# Altium project BBiQ.PrjPcb
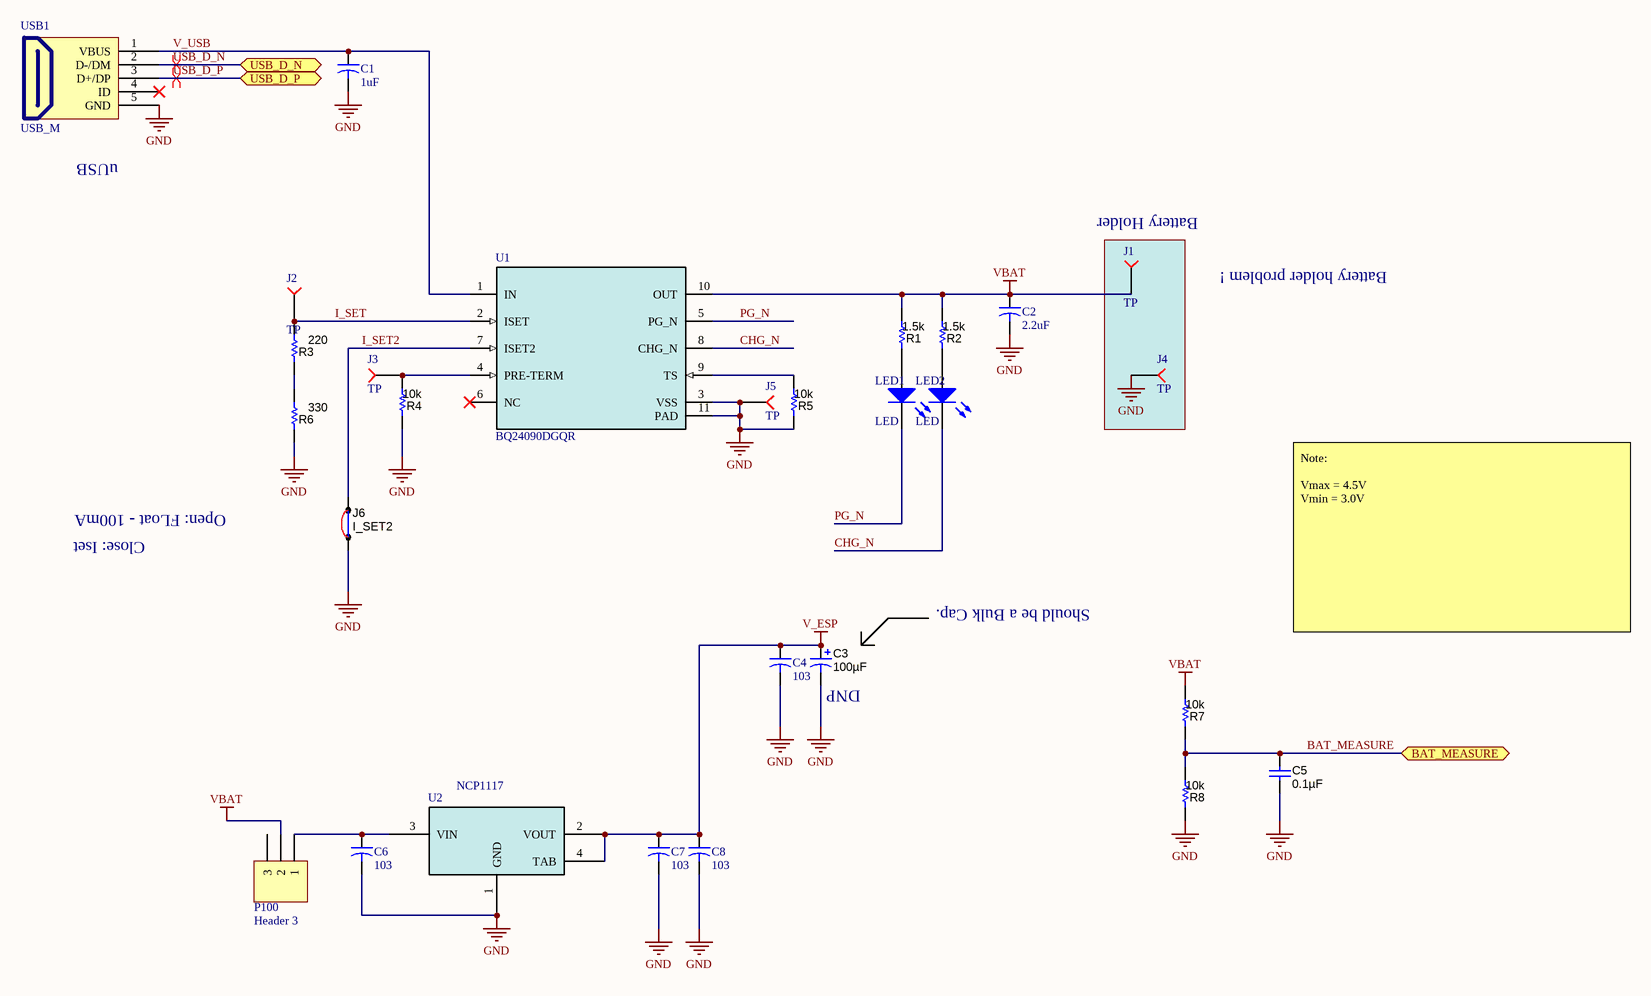
[diagram p0: [2]-Charger.SchDoc]
5 sheets, 174 parts. Net scope: flat (ports and power ports of the same name join across sheets).
Board file: BBiQ_PCB.PcbDoc
Sheets:
  [2]-Charger.SchDoc
  [1]-Cover.SchDoc
  [3]-MCU.SchDoc
  [4]-Wifi.SchDoc
  [5]-Display.SchDoc

## Sheet [2]-Charger.SchDoc
size A3

### Parts
C1  1uF  [0603]
C2  2.2uF  [0603]
C3  ValueDisplayed: 100µF  [3528-21]  (hidden comment: 293D107X96R3B2TE3)
C4  103  [0603]
C5  ValueDisplayed: 0.1µF  [0603]  (hidden comment: 0603YC104JAT2A)
C6  103  [0603]
C7  103  [0603]
C8  103  [0603]
J1  TP  [TP]
J2  TP  [TP]
J3  TP  [TP]
J4  TP  [TP]
J5  TP  [TP]
J6  I_SET2  [HDR1X2]
LED1  LED  [LED-0603-YELLOW]
LED2  LED  [LED-0603-YELLOW]
P100  Header 3  [SW_Slide]
R1  1.5k  [0603]
R2  1.5k  [0603]
R3  220  [0603]
R4  10k  [0603]
R5  10k  [0603]
R6  330  [0603]
R7  10k  [0603]
R8  10k  [0603]
U1  BQ24090DGQR  [DGQ0010D_NV_N]
U2  NCP1117  [SOT-223B_L]
USB1  USB_M  [USB_MICRO_SMD]

### Ports
BAT_MEASURE (bidir), USB_D_N (bidir), USB_D_P (bidir)

### Nets
GND: C1.2 C2.2 C3.2(-) C4.2 C5.2 C6.2 C7.2 C8.2 J4.0 J5.0 J6.1 R4.1 R5.1 R6.1 R8.1 U1.3(VSS) U1.11(PAD) U2.1(GND) USB1.5(GND)
V_ESP: C3.1(+) C4.1 C7.1 C8.1 U2.2(VOUT) U2.4(TAB)
VBAT: C2.1 J1.0 P100.2 R1.2 R2.2 R7.2 U1.10(OUT)
BAT_MEASURE: C5.1 R7.1 R8.2 ; port BAT_MEASURE
CHG_N: LED2.2(K) U1.8(CHG_N)
I_SET: J2.0 R3.2 U1.2(ISET)
I_SET2: J6.2 U1.7(ISET2)
PG_N: LED1.2(K) U1.5(PG_N)
USB_D_N: USB1.2(D-/DM) ; port USB_D_N
USB_D_P: USB1.3(D+/DP) ; port USB_D_P
V_USB: C1.1 U1.1(IN) USB1.1(VBUS)
NetC6_1: C6.1 P100.1 U2.3(VIN)
NetJ3_0: J3.0 R4.2 U1.4(PRE-TERM)
NetLED1_1: LED1.1(A) R1.1
NetLED2_1: LED2.1(A) R2.1
NetR3_1: R3.1 R6.2
NetR5_2: R5.2 U1.9(TS)

Not connected (* = marked no-connect by the designer): P100 3; U1 6(NC)*; USB1 4(ID)*

### Layout directives
differential pair: USB_D_N, USB_D_P

### Notes on the sheet
- uUSB
- (near J1) Battery Holder
- (near J1) Battery holder problem !
- Open: FLoat - 100mA
- Close: Iset
- Should be a Bulk Cap.
- Note:
  Vmax = 4.5V
  Vmin = 3.0V
- (near C3) DNP
- Title
- Size:
- Date:
- A3
- Number:
- Time:
- Revision:
- Sheet
- of
- File:

### Library data of the parts
C1 C2 C4 C6-C8 = Cap 0805: Ceramic; Published: 8-Jun-2000; LatestRevisionDate: 17-Jul-2002; LatestRevisionNote: Re-released for DXP Platform.; PackageReference: POLAR0.8; Publisher: Altium Limited
  C1: Link: http://www.digikey.com/product-detail/en/tdk-corporation/C1608X5R1E105K080AC/445-5146-2-ND/2093414
  C2 C4 C6-C8: Link: http://www.digikey.com/product-detail/en/tdk-corporation/C1608X5R1A225K080AC/445-5166-2-ND/2093434
C3 = C_293D107X96R3B2TE3: CAP, TANT, 100uF, 6.3V, +/-10%, 1.7 ohm, 3528-21 SMD; Manufacturer: Vishay-Sprague; Polarized: Y; CompType: Capacitor; U/M: EA; Cap_F: 0.0001; Tolerance_%: 10; Value1: 1.7 ohm; VDC_V: 6.3; ESR_Ohm: 1.7; IRMS_A: 0.22; TaMin_C: -55; TaMax_C: 125; Cap_Case: B; SymbolVersion: 2008-07-09; Value: 100uF; PartNumber: 293D107X96R3B2TE3; PackageReference: 3528-21; RoHS: Y; Value2: 6.3V; MountType: SMT; Technology: TA; Series: 293D; Published: 2008-06-19; Publisher: Texas Instruments; LatestRevisionDate: 2012-08-28; LatestRevisionNote: Changed Publisher; ComponentLink1Description: Datasheet link; ComponentLink1URL: http://www.vishay.com/docs/40002/293d.pdf; Alternate PartNumber: -; Alternate Manufacturer: -; Supplier 1: Digi-Key; Supplier Part Number 1: 718-1128-1-ND; Supplier 2: Farnell; Supplier Part Number 2: 1616478; Supplier 3: Newark; Supplier Part Number 3: 99M0350
C5 = Cap_0603: CAP, CERM, 0.1uF, 16V, +/-5%, X7R, 0603; Manufacturer: AVX; Polarized: N; CompType: Capacitor; U/M: EA; Cap_F: 0.0000001; Tolerance_%: 5; ESR_Ohm: 0.039; Value1: 0.039 ohm; VDC_V: 16; TaMin_C: -55; TaMax_C: 125; SymbolVersion: 2008-07-09; Value: 0.1uF; PartNumber: 0603YC104JAT2A; PackageReference: 0603; RoHS: Y; Value2: 16V; MountType: SMT; Technology: Ceramic; TempCo: X7R; Cap_Case: 0603; Published: 2008-06-19; Publisher: Texas Instruments; LatestRevisionDate: 2012-08-23; LatestRevisionNote: Changed publisher; ComponentLink1Description: Datasheet link; ComponentLink1URL: http://www.avx.com/docs/masterpubs/smccp.pdf; Alternate PartNumber: -; Alternate Manufacturer: -; Supplier 1: Digi-Key; Supplier Part Number 1: 478-3726-1-ND; Supplier 2: Farnell; Supplier Part Number 2: 1396198; Supplier 3: Arrow; Supplier Part Number 3: 0603YC104JAT2A
J1-J5 = TP: Test point (true); .Sch checked: OK; .PCB  checked: OK
J6 = 923345-02-C: Jumper Wire, 200mil spacing, Red, pkg of 200; Manufacturer: 3M; Alternate Manufacturer: Any; Alternate PartNumber: Equivalent; SymbolCreator: a0412235; U/M: EA; SymbolVersion: 2010-08-18; PartNumber: 923345-02-C; CompType: Jumper Wire; RoHS: Y; PackageReference: 200 mil Jumper Wire; MountType: TH; ComponentLink1Description: Datasheet Link; ComponentLink1URL: http://multimedia.3m.com/mws/mediawebserver?66666UuZjcFSLXTtNX&c5x&6EVuQEcuZgVs6EVs6E666666--; Publisher: Texas Instruments; LatestRevisionDate: 2012-11-04; LatestRevisionNote: Added parts, moved some to Hardware.IntLib; Supplier 1: Digi-Key; Supplier Part Number 1: 923345-02-ND; Supplier 2: Mouser; Supplier Part Number 2: 517-923345-02; Supplier 3: Newark; Supplier Part Number 3: 19M8560
LED1 LED2 = LED: Typical INFRARED GaAs LED; Published: 8-Jun-2000; LatestRevisionDate: 08-Jul-2005; LatestRevisionNote: Mech Layer 1 removed.; PackageReference: LED-0; Publisher: Altium Limited; PackageDescription: LED; 2 Leads
P100 = Header 3: Header, 3-Pin; LatestRevisionDate: 17-Jul-2002; LatestRevisionNote: Re-released for DXP Platform.; Publisher: Altium Limited
R1-R8 = R0805_025W: RES 5%, 0.125W, 0805; PartNumber: CRCW08051K00JNEA; Manufacturer: Vishay-Dale; Alternate Manufacturer: Any; Alternate PartNumber: Equivalent; CompType: Resistor; Res_ohm: 1000; Value_Code: 1k00; Tolerance_%: 5; Power_W: 0.125; VDC_V: 150; TempCo: 200 ppm/C; EIA_Code: E24; U/M: EA; SymbolVersion: 2009-05-29; PackageReference: 0805; RoHS: Y; Value1: 5%; Value2: 0.125W; MountType: SMT; Technology: Thick Film; Published: 2008-06-26; Publisher: Texas Instruments; LatestRevisionDate: 2012-10-04; LatestRevisionNote: Changed publisher; ComponentLink1Description: Datasheet link; ComponentLink1URL: http://www.vishay.com/docs/20035/dcrcwe3.pdf; Supplier 1: Digi-Key; Supplier Part Number 1: 541-1.0KACT-ND; Supplier 2: Farnell; Supplier Part Number 2: 1562615; Supplier 3: Newark; Supplier Part Number 3: 52K9725
  R1 R2: Value: 1.5k
  R3: Value: 220
  R4 R5 R7 R8: Value: 10k
  R6: Value: 330
U1 = BQ24090DGQR: Single Cell Li-Ion and Li-Pol Battery Charger; Alternate PartNumber: BQ24090DGQT; Manufacturer: Texas Instruments; CompType: IC; PIN_COUNT: 11; Application_BuildNumber: *; SymbolVerison: 2014-09-25; PartNumber: BQ24090DGQR; PackageReference: DGQ0010D; MountType: SMT; RoHS: Y; RefDes: RefDes; Type: DEV; Value: Value
U2 = NCP1117: 1000mA Low-Dropout Positive Fixed and Adjustable Voltage Regulators; RefDes: RefDes; Type: DEV; Value: Value; Price (1k-$): 0.15686; Datasheet Link: http://www.onsemi.com/pub_link/Collateral/NCP1117-D.PDF; Digikey Part: NCP1117ST33T3GOSTR-ND

## Sheet [1]-Cover.SchDoc
size A3
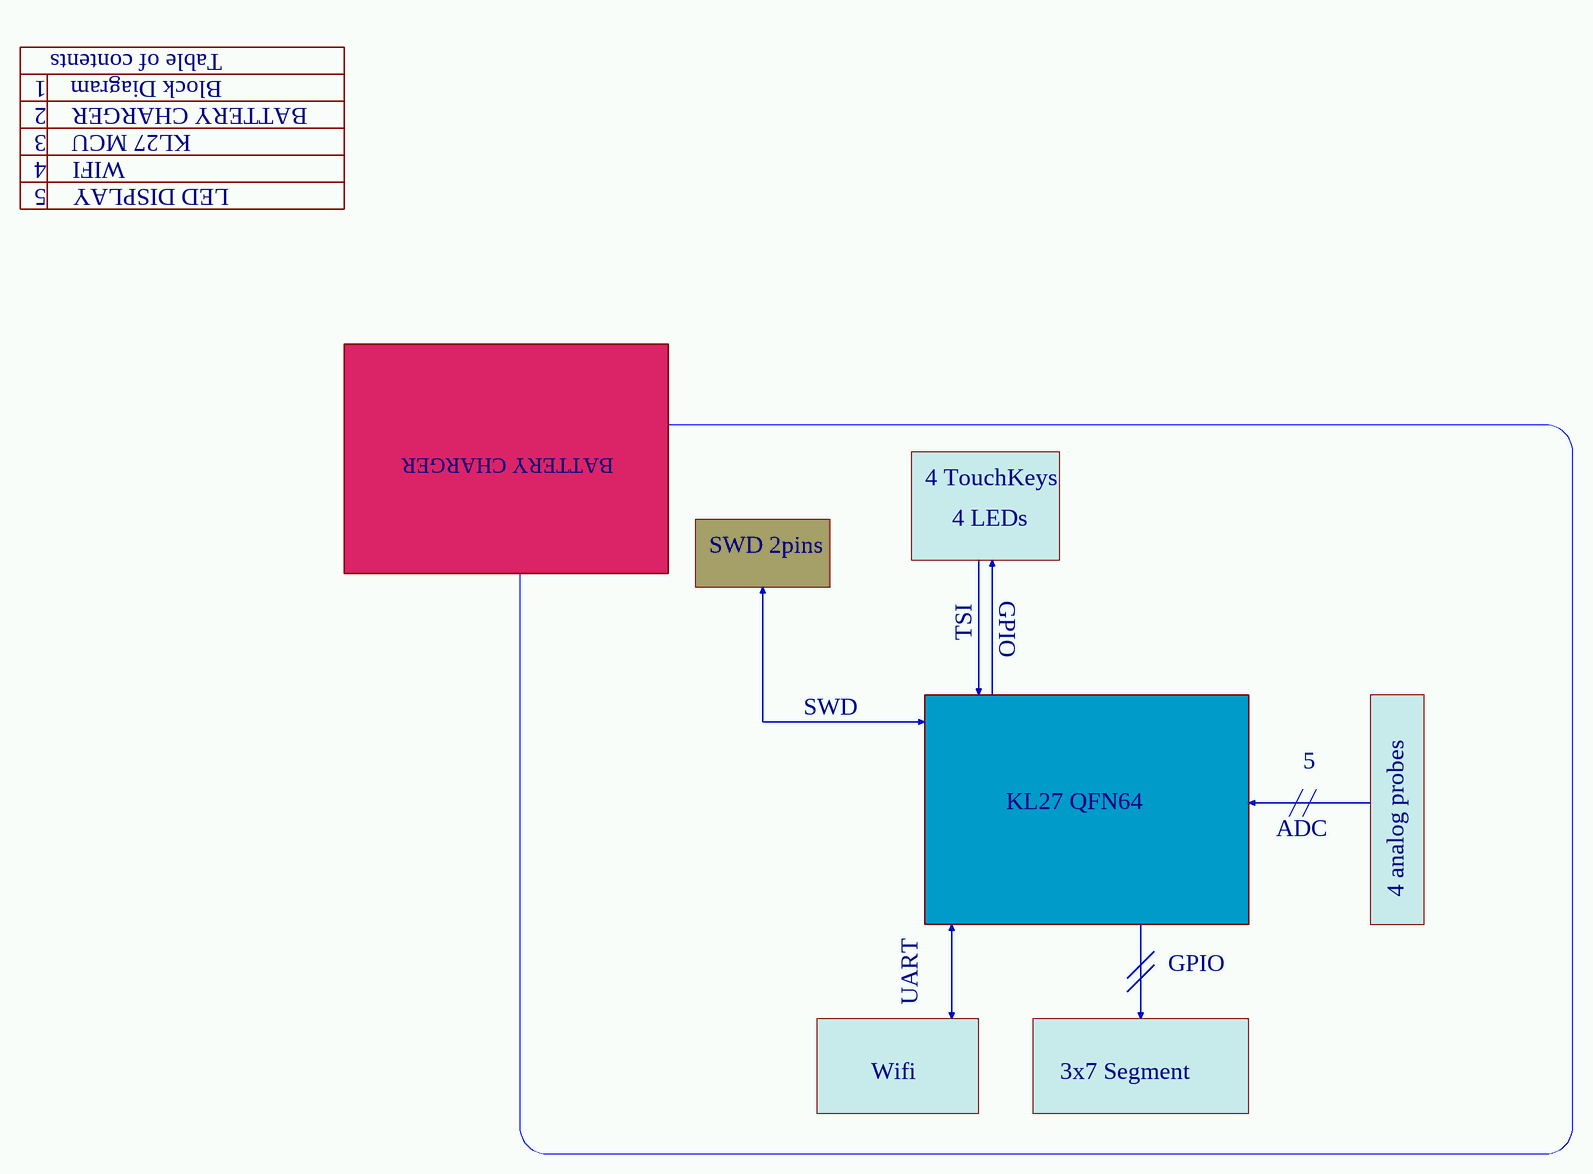
[diagram p1: [1]-Cover.SchDoc]

### Notes on the sheet
- Table of contents
- 1
- 2
- Block Diagram
- BATTERY CHARGER
- 3
- 4
- 5
- WIFI
- KL27 MCU
- LED DISPLAY
- 4 TouchKeys
- SWD 2pins
- 4 LEDs
- TSI
- GPIO
- SWD
- KL27 QFN64
- ADC
- 4 analog probes
- UART
- Wifi
- 3x7 Segment
- Title
- Size:
- Date:
- A3
- Number:
- Time:
- Revision:
- Sheet
- of
- File:

## Sheet [3]-MCU.SchDoc
size A3
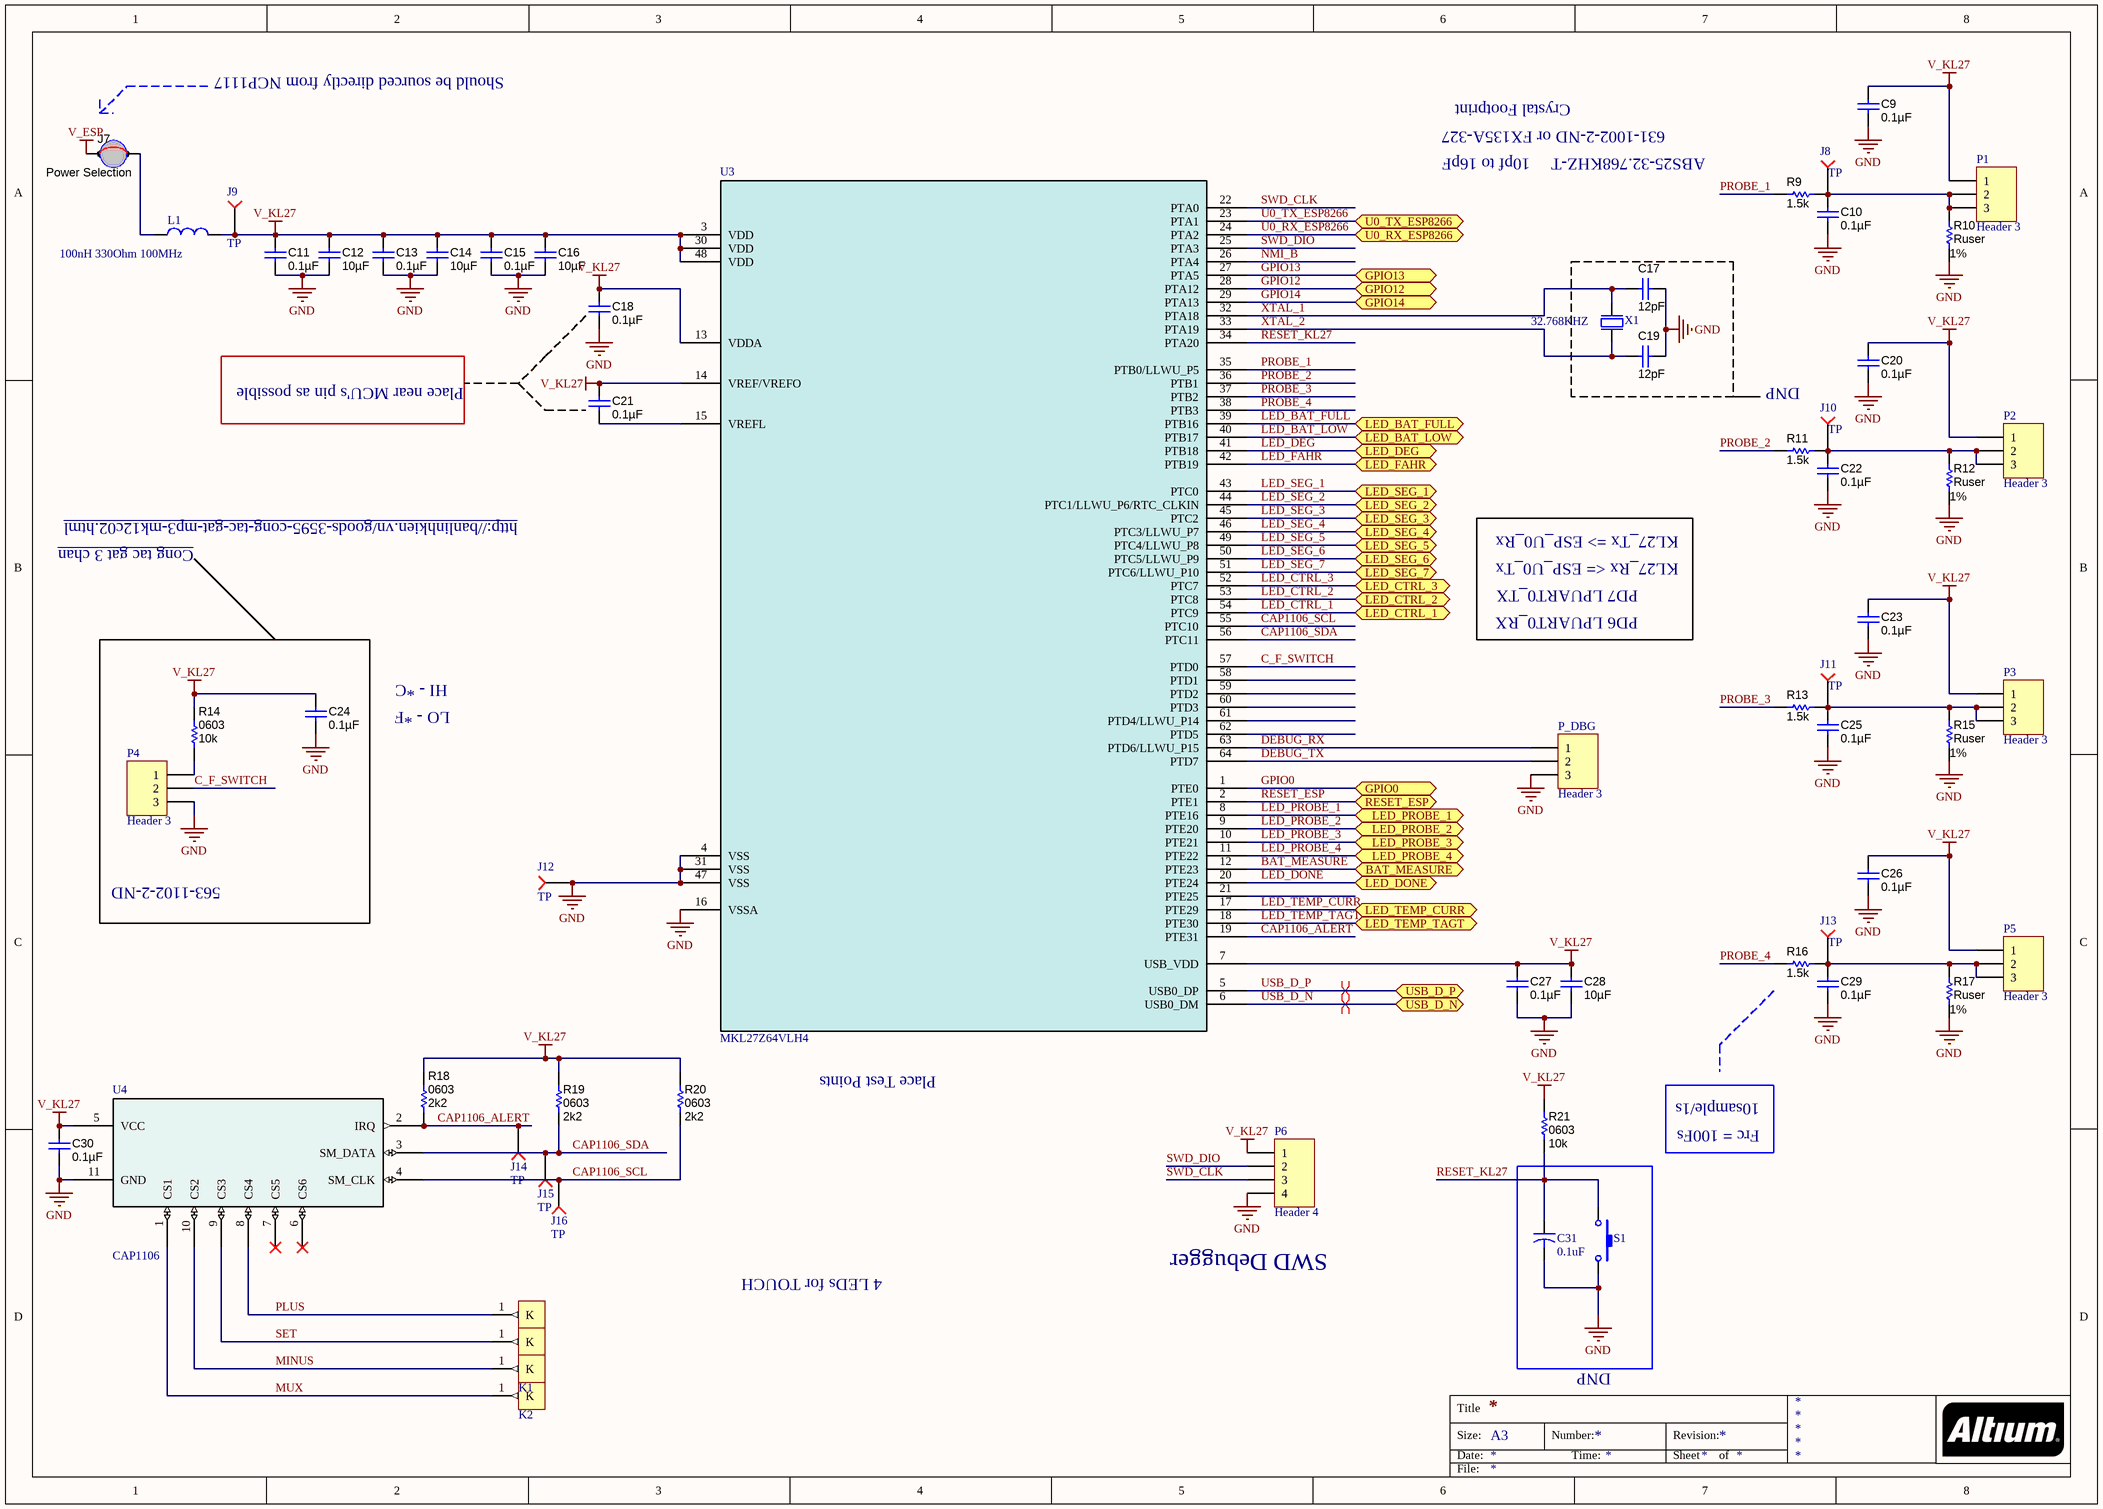
[diagram p2: [3]-MCU.SchDoc]

### Parts
C9  ValueDisplayed: 0.1µF  [0603]  (hidden comment: 0603YC104JAT2A)
C10  ValueDisplayed: 0.1µF  [0603]  (hidden comment: 0603YC104JAT2A)
C11  ValueDisplayed: 0.1µF  [0603]  (hidden comment: 0603YC104JAT2A)
C12  ValueDisplayed: 10µF  [0603]  (hidden comment: 0603YC104JAT2A)
C13  ValueDisplayed: 0.1µF  [0603]  (hidden comment: 0603YC104JAT2A)
C14  ValueDisplayed: 10µF  [0603]  (hidden comment: 0603YC104JAT2A)
C15  ValueDisplayed: 0.1µF  [0603]  (hidden comment: 0603YC104JAT2A)
C16  ValueDisplayed: 10µF  [0603]  (hidden comment: 0603YC104JAT2A)
C17  ValueDisplayed: 12pF  [0603]  (hidden comment: 0603YC104JAT2A)
C18  ValueDisplayed: 0.1µF  [0603]  (hidden comment: 0603YC104JAT2A)
C19  ValueDisplayed: 12pF  [0603]  (hidden comment: 0603YC104JAT2A)
C20  ValueDisplayed: 0.1µF  [0603]  (hidden comment: 0603YC104JAT2A)
C21  ValueDisplayed: 0.1µF  [0603]  (hidden comment: 0603YC104JAT2A)
C22  ValueDisplayed: 0.1µF  [0603]  (hidden comment: 0603YC104JAT2A)
C23  ValueDisplayed: 0.1µF  [0603]  (hidden comment: 0603YC104JAT2A)
C24  ValueDisplayed: 0.1µF  [0603]  (hidden comment: 0603YC104JAT2A)
C25  ValueDisplayed: 0.1µF  [0603]  (hidden comment: 0603YC104JAT2A)
C26  ValueDisplayed: 0.1µF  [0603]  (hidden comment: 0603YC104JAT2A)
C27  ValueDisplayed: 0.1µF  [0603]  (hidden comment: 0603YC104JAT2A)
C28  ValueDisplayed: 10µF  [0603]  (hidden comment: 0603YC104JAT2A)
C29  ValueDisplayed: 0.1µF  [0603]  (hidden comment: 0603YC104JAT2A)
C30  ValueDisplayed: 0.1µF  [0603]  (hidden comment: 0603YC104JAT2A)
C31  0.1uF  [0603]
J7  Power Selection  [HDR1X2]
J8  TP  [TP]
J9  TP  [TP]
J10  TP  [TP]
J11  TP  [TP]
J12  TP  [TP]
J13  TP  [TP]
J14  TP  [TP]
J15  TP  [TP]
J16  TP  [TP]
K1  Single_Key  [PAD_FINGETIP]  (value not drawn)
K2  Single_Key  [PAD_FINGETIP]  (value not drawn)
K3  Single_Key  [PAD_FINGETIP]  (value not drawn)
K4  Single_Key  [PAD_FINGETIP]  (value not drawn)
L1  100nH 330Ohm 100MHz  [0805]
P1  Header 3  [JACK_MONO]
P2  Header 3  [JACK_MONO]
P3  Header 3  [JACK_MONO]
P4  Header 3  [SW_Slide]
P5  Header 3  [JACK_MONO]
P6  Header 4  [hdR1x4]
P_DBG  Header 3  [HDR1X3]
R9  value 1.5k  [0603]  (hidden comment: CRCW06031K00FKEA)
R10  value Ruser  Value1: 1%  [0603]  (hidden comment: CRCW06031K00FKEA)
R11  value 1.5k  [0603]  (hidden comment: CRCW06031K00FKEA)
R12  value Ruser  Value1: 1%  [0603]  (hidden comment: CRCW06031K00FKEA)
R13  value 1.5k  [0603]  (hidden comment: CRCW06031K00FKEA)
R14  value 10k  [0603]  (hidden comment: CRCW08051K00JNEA)
R15  value Ruser  Value1: 1%  [0603]  (hidden comment: CRCW06031K00FKEA)
R16  value 1.5k  [0603]  (hidden comment: CRCW06031K00FKEA)
R17  value Ruser  Value1: 1%  [0603]  (hidden comment: CRCW06031K00FKEA)
R18  value 2k2  [0603]  (hidden comment: CRCW08051K00JNEA)
R19  value 2k2  [0603]  (hidden comment: CRCW08051K00JNEA)
R20  value 2k2  [0603]  (hidden comment: CRCW08051K00JNEA)
R21  value 10k  [0603]  (hidden comment: CRCW08051K00JNEA)
S1  SW-SMD  [SW-SMD]  (value not drawn)
U3  MKL27Z64VLH4  [98ASS23234W]
U4  CAP1106  [TDFN33-10pin]
X1  32.768KHZ  [XTAL_3215]

### Blocks framed on the sheet
563-1102-2-ND: C24 P4 R14
DNP: C31 S1

### Ports
BAT_MEASURE (bidir), GPIO0 (bidir), GPIO12 (bidir), GPIO13 (bidir), GPIO14 (bidir), LED_BAT_FULL (bidir), LED_BAT_LOW (bidir), LED_CTRL_1 (bidir), LED_CTRL_2 (bidir), LED_CTRL_3 (bidir), LED_DEG (bidir), LED_DONE (bidir), LED_FAHR (bidir), LED_PROBE_1 (bidir), LED_PROBE_2 (bidir), LED_PROBE_3 (bidir), LED_PROBE_4 (bidir), LED_SEG_1 (bidir), LED_SEG_2 (bidir), LED_SEG_3 (bidir), LED_SEG_4 (bidir), LED_SEG_5 (bidir), LED_SEG_6 (bidir), LED_SEG_7 (bidir), LED_TEMP_CURR (bidir), LED_TEMP_TAGT (bidir), RESET_ESP (bidir), U0_RX_ESP8266 (bidir), U0_TX_ESP8266 (bidir), USB_D_N (bidir), USB_D_P (bidir)

### Nets
GND: C9.2 C10.2 C11.2 C12.2 C13.2 C14.2 C15.2 C16.2 C17.2 C18.2 C19.2 C20.2 C22.2 C23.2 C24.2 C25.2 C26.2 C27.2 C28.2 C29.2 C30.2 C31.2 J12.0 P4.3 P6.4 P_DBG.3 R10.1 R12.1 R15.1 R17.1 S1.2 U3.4(VSS) U3.16(VSSA) U3.31(VSS) U3.47(VSS) U4.11(GND)
V_ESP: J7.1
V_KL27: C9.1 C11.1 C12.1 C13.1 C14.1 C15.1 C16.1 C18.1 C20.1 C21.1 C23.1 C24.1 C26.1 C27.1 C28.1 C30.1 J9.0 L1.2 P1.1 P2.1 P3.1 P5.1 P6.1 R14.1 R18.1 R19.1 R20.1 R21.1 U3.3(VDD) U3.7(USB_VDD) U3.13(VDDA) U3.14(VREF/VREFO) U3.30(VDD) U3.48(VDD) U4.5(VCC)
BAT_MEASURE: U3.12(PTE23) ; port BAT_MEASURE
C_F_SWITCH: P4.2 U3.57(PTD0)
CAP1106_ALERT: J14.0 R18.2 U3.19(PTE31) U4.2(IRQ)
CAP1106_SCL: J16.0 R20.2 U3.55(PTC10) U4.4(SM_CLK)
CAP1106_SDA: J15.0 R19.2 U3.56(PTC11) U4.3(SM_DATA)
DEBUG_RX: P_DBG.1 U3.63(PTD6/LLWU_P15)
DEBUG_TX: P_DBG.2 U3.64(PTD7)
GPIO0: U3.1(PTE0) ; port GPIO0
GPIO12: U3.28(PTA12) ; port GPIO12
GPIO13: U3.27(PTA5) ; port GPIO13
GPIO14: U3.29(PTA13) ; port GPIO14
LED_BAT_FULL: U3.39(PTB16) ; port LED_BAT_FULL
LED_BAT_LOW: U3.40(PTB17) ; port LED_BAT_LOW
LED_CTRL_1: U3.54(PTC9) ; port LED_CTRL_1
LED_CTRL_2: U3.53(PTC8) ; port LED_CTRL_2
LED_CTRL_3: U3.52(PTC7) ; port LED_CTRL_3
LED_DEG: U3.41(PTB18) ; port LED_DEG
LED_DONE: U3.20(PTE24) ; port LED_DONE
LED_FAHR: U3.42(PTB19) ; port LED_FAHR
LED_PROBE_1: U3.8(PTE16) ; port LED_PROBE_1
LED_PROBE_2: U3.9(PTE20) ; port LED_PROBE_2
LED_PROBE_3: U3.10(PTE21) ; port LED_PROBE_3
LED_PROBE_4: U3.11(PTE22) ; port LED_PROBE_4
LED_SEG_1: U3.43(PTC0) ; port LED_SEG_1
LED_SEG_2: U3.44(PTC1/LLWU_P6/RTC_CLKIN) ; port LED_SEG_2
LED_SEG_3: U3.45(PTC2) ; port LED_SEG_3
LED_SEG_4: U3.46(PTC3/LLWU_P7) ; port LED_SEG_4
LED_SEG_5: U3.49(PTC4/LLWU_P8) ; port LED_SEG_5
LED_SEG_6: U3.50(PTC5/LLWU_P9) ; port LED_SEG_6
LED_SEG_7: U3.51(PTC6/LLWU_P10) ; port LED_SEG_7
LED_TEMP_CURR: U3.17(PTE29) ; port LED_TEMP_CURR
LED_TEMP_TAGT: U3.18(PTE30) ; port LED_TEMP_TAGT
MINUS: K1.1(K) U4.10(CS2)
MUX: K2.1(K) U4.1(CS1)
NMI_B: U3.26(PTA4)
PLUS: K4.1(K) U4.8(CS4)
PROBE_1: R9.2 U3.35(PTB0/LLWU_P5)
PROBE_2: R11.2 U3.36(PTB1)
PROBE_3: R13.2 U3.37(PTB2)
PROBE_4: R16.2 U3.38(PTB3)
RESET_ESP: U3.2(PTE1) ; port RESET_ESP
RESET_KL27: C31.1 R21.2 S1.1 U3.34(PTA20)
SET: K3.1(K) U4.9(CS3)
SWD_CLK: P6.3 U3.22(PTA0)
SWD_DIO: P6.2 U3.25(PTA3)
U0_RX_ESP8266: U3.24(PTA2) ; port U0_RX_ESP8266
U0_TX_ESP8266: U3.23(PTA1) ; port U0_TX_ESP8266
USB_D_N: U3.6(USB0_DM) ; port USB_D_N
USB_D_P: U3.5(USB0_DP) ; port USB_D_P
XTAL_1: C17.1 U3.32(PTA18) X1.2(out)
XTAL_2: C19.1 U3.33(PTA19) X1.1(inp)
NetC10_1: C10.1 J8.0 P1.2 P1.3 R9.1 R10.2
NetC21_2: C21.2 U3.15(VREFL)
NetC22_1: C22.1 J10.0 P2.2 P2.3 R11.1 R12.2
NetC25_1: C25.1 J11.0 P3.2 P3.3 R13.1 R15.2
NetC29_1: C29.1 J13.0 P5.2 P5.3 R16.1 R17.2
NetJ7_2: J7.2 L1.1
NetP4_1: P4.1 R14.2

Not connected (* = marked no-connect by the designer): U3 21(PTE25) 58(PTD1) 59(PTD2) 60(PTD3) 61(PTD4/LLWU_P14) 62(PTD5); U4 6(CS6)* 7(CS5)*

### Layout directives
differential pair: USB_D_N, USB_D_P

### Notes on the sheet
- Should be sourced directly from NCP1117
- Crystal Footprint
- 10pf to 16pF
- 631-1002-2-ND or FX135A-327
- ABS25-32.768KHZ-T
- Place near MCU's pin as possible
- DNP
- http://banlinhkien.vn/goods-3595-cong-tac-gat-mp3-mk12c02.html
- Cong tac gat 3 chan
- PD7 LPUART0_TX
- KL27_Tx => ESP_U0_Rx
- KL27_Rx <= ESP_U0_Tx
- PD6 LPUART0_RX
- HI - *C
- LO - *F
- Place Test Points
- 10sample/1s
- Frc = 100Fs
- SWD Debugger
- 4 LEDs for TOUCH
- Title
- Size:
- Date:
- A3
- Number:
- Time:
- Revision:
- Sheet
- of
- File:

### Library data of the parts
C9-C30 = Cap_0603: as C5 on sheet [2]-Charger; SymbolVersion: 2008-07-09; Value: 0.1uF; PartNumber: 0603YC104JAT2A; PackageReference: 0603; RoHS: Y; Value2: 16V; MountType: SMT; Technology: Ceramic; TempCo: X7R; Cap_Case: 0603; Published: 2008-06-19; Publisher: Texas Instruments; LatestRevisionDate: 2012-08-23; LatestRevisionNote: Changed publisher; ComponentLink1Description: Datasheet link; ComponentLink1URL: http://www.avx.com/docs/masterpubs/smccp.pdf; Alternate PartNumber: -; Alternate Manufacturer: -; Supplier 1: Digi-Key; Supplier Part Number 1: 478-3726-1-ND; Supplier 2: Farnell; Supplier Part Number 2: 1396198; Supplier 3: Arrow; Supplier Part Number 3: 0603YC104JAT2A
C31 = Cap 0805: Ceramic; Published: 8-Jun-2000; LatestRevisionDate: 17-Jul-2002; LatestRevisionNote: Re-released for DXP Platform.; PackageReference: POLAR0.8; Publisher: Altium Limited
J7 = 923345-02-C: as J6 on sheet [2]-Charger; SymbolVersion: 2010-08-18; PartNumber: 923345-02-C; CompType: Jumper Wire; RoHS: Y; PackageReference: 200 mil Jumper Wire; MountType: TH; ComponentLink1Description: Datasheet Link; ComponentLink1URL: http://multimedia.3m.com/mws/mediawebserver?66666UuZjcFSLXTtNX&c5x&6EVuQEcuZgVs6EVs6E666666--; Publisher: Texas Instruments; LatestRevisionDate: 2012-11-04; LatestRevisionNote: Added parts, moved some to Hardware.IntLib; Supplier 1: Digi-Key; Supplier Part Number 1: 923345-02-ND; Supplier 2: Mouser; Supplier Part Number 2: 517-923345-02; Supplier 3: Newark; Supplier Part Number 3: 19M8560
J8-J16 = TP: Test point (true); .Sch checked: OK; .PCB  checked: OK
K1-K4 = Single_Key: Single Key Touch; Sharpe: Round/Square; Name: Single Touch Key; Created by: TuongPV
L1 = L1: Inductor; Value: 150 mH
P1-P5 P_DBG = Header 3: Header, 3-Pin; LatestRevisionDate: 17-Jul-2002; LatestRevisionNote: Re-released for DXP Platform.; Publisher: Altium Limited
P6 = Header 4: Header, 4-Pin; LatestRevisionDate: 17-Jul-2002; LatestRevisionNote: Re-released for DXP Platform.; Publisher: Altium Limited
R9-R13 R15-R17 = R0603: RES, 1.00k ohm, 1%, 0.1W, 0603; Manufacturer: Vishay-Dale; Alternate Manufacturer: Any; Alternate PartNumber: Equivalent; CompType: Resistor; Res_ohm: 1000; Value_Code: 1k00; Tolerance_%: 1; Power_W: 0.1; VDC_V: 75; TempCo: 100 ppm/C; EIA_Code: E96; U/M: EA; SymbolVersion: 2009-05-29; PartNumber: CRCW06031K00FKEA; PackageReference: 0603; RoHS: Y; Value2: 0.1W; MountType: SMT; Technology: Thick Film; Published: 2008-06-26; Publisher: Texas Instruments; LatestRevisionDate: 2012-10-04; LatestRevisionNote: Changed publisher; ComponentLink1Description: Datasheet link; ComponentLink1URL: http://www.vishay.com/docs/20035/dcrcwe3.pdf; Supplier 1: Digi-Key; Supplier Part Number 1: 541-1.00KHCT-ND; Supplier 2: Farnell; Supplier Part Number 2: 1151593; Supplier 3: Newark; Supplier Part Number 3: 52K8015
  R9 R11 R13 R16: Value1: 1%
R14 R18-R21 = R0805_025W: RES 5%, 0.125W, 0805; Manufacturer: Vishay-Dale; Alternate Manufacturer: Any; Alternate PartNumber: Equivalent; CompType: Resistor; Res_ohm: 1000; Value_Code: 1k00; Tolerance_%: 5; Power_W: 0.125; VDC_V: 150; TempCo: 200 ppm/C; EIA_Code: E24; U/M: EA; SymbolVersion: 2009-05-29; PartNumber: CRCW08051K00JNEA; PackageReference: 0805; RoHS: Y; Value1: 0603; Value2: 0.125W; MountType: SMT; Technology: Thick Film; Published: 2008-06-26; Publisher: Texas Instruments; LatestRevisionDate: 2012-10-04; LatestRevisionNote: Changed publisher; ComponentLink1Description: Datasheet link; ComponentLink1URL: http://www.vishay.com/docs/20035/dcrcwe3.pdf; Supplier 1: Digi-Key; Supplier Part Number 1: 541-1.0KACT-ND; Supplier 2: Farnell; Supplier Part Number 2: 1562615; Supplier 3: Newark; Supplier Part Number 3: 52K9725
S1 = SW-SMD: Switch; Published: 24-Mar-1999; LatestRevisionDate: 17-Jul-2002; LatestRevisionNote: Re-released for DXP Platform.; PackageReference: SPST-2; Publisher: Altium Limited
U3 = MKL27Z64VLH4: ARM cortex M0+ 64Kb Flash LQFP-64; Vendor: Freescale; Manufacturer_Part_Number: mkl27z64vlh4; RefDes: RefDes; Type: DEV; Value: Value; Footprint: LQFP-64
U4 = CAP1106: 6 Channel Capacitive Touch Sensor; Manufacturer: Microchip; CompType: IC; PIN_COUNT: 11; Application_BuildNumber: *; PartNumber: CAP1106; MountType: SMT; RoHS: Y
X1 = XTAL_SMD3215: XTAL SMD 3215, 32.768kHz, 9pF, ±20ppm; Part Number: XTAL_FC-135 32.768k; Manufacturer: Epson Toyocom; Manufacturer Part Number: FC-135 32.768KHZ ±20PPM,9.0PF; 2nd source part number: 127-8037; Note: XTAL SMD 32.768kHz, 3215; Artikkelnr Noca: 22019091; Artikkelnr Simpro: N.A.; Datasheet: http://www.farnell.com/datasheets/57480.pdf; LatestRevisionDate: 2014-03-27; Pin Count: 2; Publisher: Nordic Semiconductor; Published: 2010-10-18; Value: 32.768kHz; Supplier: Digi-Key; Supplier part number: FC-135 32.7680KA-AC-ND; 2nd source Supplier: Farnell; Footprint Doc: XTAL_3215

## Sheet [4]-Wifi.SchDoc
size A3
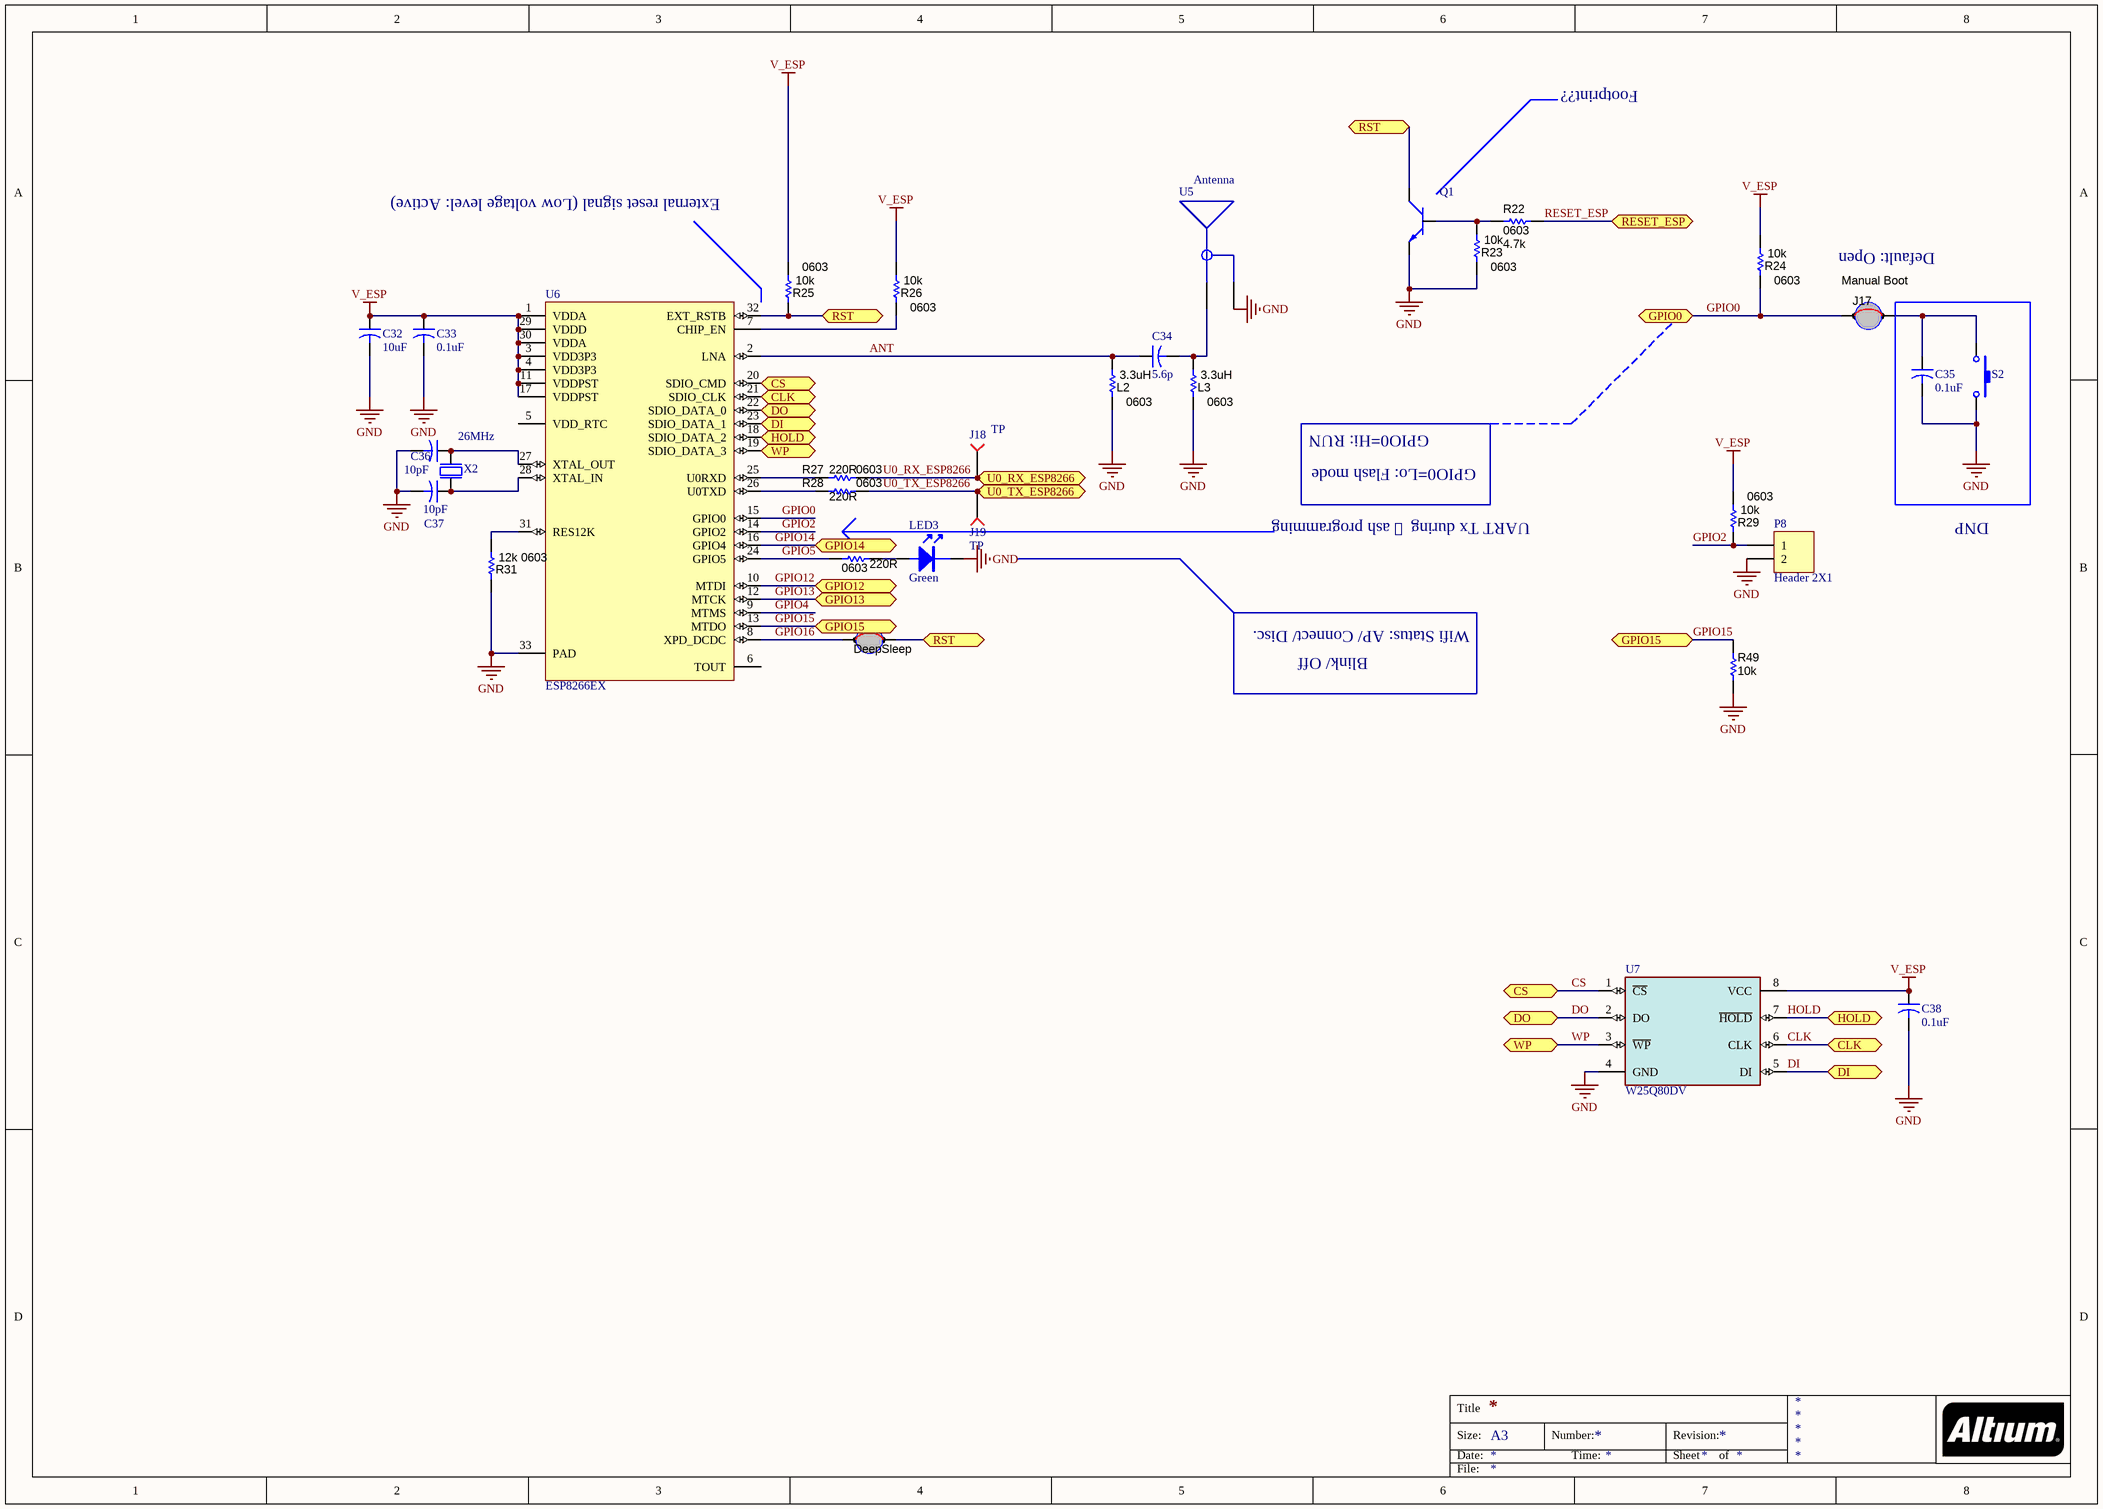
[diagram p3: [4]-Wifi.SchDoc]

### Parts
C32  10uF  [0603]
C33  0.1uF  [0603]
C34  5.6p  [0402]
C35  0.1uF  [0603]
C36  10pF  [0402]
C37  10pF  [0402]
C38  0.1uF  [0603]
J17  Manual Boot  [HDR1X2]
J18  TP  [TP]
J19  TP  [TP]
J20  DeepSleep  [HDR1X2]
L2  value 3.3uH  Value1: 0603  [0402]  (hidden comment: CRCW08051K00JNEA)
L3  value 3.3uH  Value1: 0603  [0402]  (hidden comment: CRCW08051K00JNEA)
LED3  Green  [led0603]
P8  Header 2X1  [hdr1X2]
Q1  MMBT2222A  [SOT23A]  (value not drawn)
R22  value 4.7k  [0603]  (hidden comment: CRCW08051K00JNEA)
R23  value 10k  [0603]  (hidden comment: CRCW08051K00JNEA)
R24  value 10k  [0603]  (hidden comment: CRCW08051K00JNEA)
R25  value 10k  [0603]  (hidden comment: CRCW08051K00JNEA)
R26  value 10k  [0603]  (hidden comment: CRCW08051K00JNEA)
R27  value 220R  [0603]  (hidden comment: CRCW08051K00JNEA)
R28  value 220R  [0603]  (hidden comment: CRCW08051K00JNEA)
R29  value 10k  [0603]  (hidden comment: CRCW08051K00JNEA)
R30  value 220R  [0603]  (hidden comment: CRCW08051K00JNEA)
R31  value 12k 0603  [0603]  (hidden comment: CRCW08051K00JNEA)
R49  value 10k  [0603]  (hidden comment: CRCW06031K00FKEA)
S2  SW-SMD  [SW-SMD]  (value not drawn)
U5  Antenna  [ANT_F]
U6  ESP8266EX  [QFN32_ESP8266]
U7  W25Q80DV  [SOIC8_208mil]
X2  26MHz  [BT-XTAL_3225]

### Ports
CLK (bidir), CS (bidir), DI (bidir), DO (bidir), GPIO0 (bidir), GPIO12 (bidir), GPIO13 (bidir), GPIO14 (bidir), GPIO15 (bidir), HOLD (bidir), RESET_ESP (bidir), RST (bidir), U0_RX_ESP8266 (bidir), U0_TX_ESP8266 (bidir), WP (bidir)

### Nets
GND: C32.2 C33.2 C35.2 C36.2 C37.2 C38.2 L2.1 L3.1 LED3.2 P8.2 Q1.2(E) R23.1 R31.1 R49.2 S2.2 U5.2(GND) U6.33(PAD) U7.4(GND) X2.2(GND) X2.4(GND)
V_ESP: C32.1 C33.1 C38.1 R24.2 R25.2 R26.2 R29.2 U6.1(VDDA) U6.3(VDD3P3) U6.4(VDD3P3) U6.11(VDDPST) U6.17(VDDPST) U6.29(VDDD) U6.30(VDDA) U7.8(VCC)
ANT: C34.1 L2.2 U6.2(LNA)
CLK: U6.21(SDIO_CLK) U7.6(CLK) ; port CLK
CS: U6.20(SDIO_CMD) U7.1(~{CS}) ; port CS
DI: U6.23(SDIO_DATA_1) U7.5(DI) ; port DI
DO: U6.22(SDIO_DATA_0) U7.2(DO) ; port DO
GPIO0: J17.1 R24.1 U6.15(GPIO0) ; port GPIO0
GPIO2: P8.1 R29.1 U6.14(GPIO2)
GPIO4: U6.9(MTMS)
GPIO5: R30.2 U6.24(GPIO5)
GPIO12: U6.10(MTDI) ; port GPIO12
GPIO13: U6.12(MTCK) ; port GPIO13
GPIO14: U6.16(GPIO4) ; port GPIO14
GPIO15: R49.1 U6.13(MTDO) ; port GPIO15
GPIO16: J20.1 U6.8(XPD_DCDC)
HOLD: U6.18(SDIO_DATA_2) U7.7(~{HOLD}) ; port HOLD
RESET_ESP: R22.1 ; port RESET_ESP
U0_RX_ESP8266: J18.0 R27.1 ; port U0_RX_ESP8266
U0_TX_ESP8266: J19.0 R28.1 ; port U0_TX_ESP8266
WP: U6.19(SDIO_DATA_3) U7.3(~{WP}) ; port WP
NetC34_2: C34.2 L3.2 U5.1(ANT)
NetC35_1: C35.1 J17.2 S2.1
NetC36_1: C36.1 U6.27(XTAL_OUT) X2.3(out)
NetC37_1: C37.1 U6.28(XTAL_IN) X2.1(inp)
NetJ20_2: J20.2 Q1.3(C) R25.1 U6.32(EXT_RSTB) ; port RST
NetLED3_1: LED3.1 R30.1
NetQ1_1: Q1.1(B) R22.2 R23.2
NetR26_1: R26.1 U6.7(CHIP_EN)
NetR27_2: R27.2 U6.25(U0RXD)
NetR28_2: R28.2 U6.26(U0TXD)
NetR31_2: R31.2 U6.31(RES12K)

Not connected (* = marked no-connect by the designer): U6 5(VDD_RTC) 6(TOUT)

### Notes on the sheet
- Footprint??
- External reset signal (Low voltage level: Active)
- Default: Open
- GPIO0=Hi: RUN
- GPIO0=Lo: Flash mode
- UART Tx during ﬂash programming
- DNP
- Blink/ Off
- Wifi Status: AP/ Connect/ Disc.
- Title
- Size:
- Date:
- A3
- Number:
- Time:
- Revision:
- Sheet
- of
- File:

### Library data of the parts
C32-C38 = Cap 0805: Ceramic; Published: 8-Jun-2000; LatestRevisionDate: 17-Jul-2002; LatestRevisionNote: Re-released for DXP Platform.; PackageReference: POLAR0.8; Publisher: Altium Limited
J17 J20 = 923345-02-C: as J6 on sheet [2]-Charger; SymbolVersion: 2010-08-18; PartNumber: 923345-02-C; CompType: Jumper Wire; RoHS: Y; PackageReference: 200 mil Jumper Wire; MountType: TH; ComponentLink1Description: Datasheet Link; ComponentLink1URL: http://multimedia.3m.com/mws/mediawebserver?66666UuZjcFSLXTtNX&c5x&6EVuQEcuZgVs6EVs6E666666--; Publisher: Texas Instruments; LatestRevisionDate: 2012-11-04; LatestRevisionNote: Added parts, moved some to Hardware.IntLib; Supplier 1: Digi-Key; Supplier Part Number 1: 923345-02-ND; Supplier 2: Mouser; Supplier Part Number 2: 517-923345-02; Supplier 3: Newark; Supplier Part Number 3: 19M8560
J18 J19 = TP: Test point (true); .Sch checked: OK; .PCB  checked: OK
L2 L3 R22-R31 = R0805_025W: as R14 on sheet [3]-MCU; SymbolVersion: 2009-05-29; PartNumber: CRCW08051K00JNEA; PackageReference: 0805; RoHS: Y; Value2: 0.125W; MountType: SMT; Technology: Thick Film; Published: 2008-06-26; Publisher: Texas Instruments; LatestRevisionDate: 2012-10-04; LatestRevisionNote: Changed publisher; ComponentLink1Description: Datasheet link; ComponentLink1URL: http://www.vishay.com/docs/20035/dcrcwe3.pdf; Supplier 1: Digi-Key; Supplier Part Number 1: 541-1.0KACT-ND; Supplier 2: Farnell; Supplier Part Number 2: 1562615; Supplier 3: Newark; Supplier Part Number 3: 52K9725
  R22-R30: Value1: 0603
  R31: Value1: 5%
LED3 = LEDSMD: LED SMD; LED: SMD 0603
P8 = Header 2X1: Header, 2-Pin; LatestRevisionDate: 17-Jul-2002; LatestRevisionNote: Re-released for DXP Platform.; Publisher: Altium Limited
Q1 = MMBT2222A: NPN switching transistor  40V 600mA SOT23; Manufacturer: Fairchild; Ic: 1000mA; Name: MMBT2222; Vce: 40V; Datasheet: http://www.farnell.com/datasheets/1842966.pdf; Footprint: SOT23
R49 = R0603: as R9 on sheet [3]-MCU; SymbolVersion: 2009-05-29; PartNumber: CRCW06031K00FKEA; PackageReference: 0603; RoHS: Y; Value1: 1%; Value2: 0.1W; MountType: SMT; Technology: Thick Film; Published: 2008-06-26; Publisher: Texas Instruments; LatestRevisionDate: 2012-10-04; LatestRevisionNote: Changed publisher; ComponentLink1Description: Datasheet link; ComponentLink1URL: http://www.vishay.com/docs/20035/dcrcwe3.pdf; Supplier 1: Digi-Key; Supplier Part Number 1: 541-1.00KHCT-ND; Supplier 2: Farnell; Supplier Part Number 2: 1151593; Supplier 3: Newark; Supplier Part Number 3: 52K8015
S2 = SW-SMD: Switch; Published: 24-Mar-1999; LatestRevisionDate: 17-Jul-2002; LatestRevisionNote: Re-released for DXP Platform.; PackageReference: SPST-2; Publisher: Altium Limited
U6 = ESP8266EX: ESP8266EX Espressif Systems; PIN_COUNT: 32; Datasheet URL: https://www.adafruit.com/images/product-files/2471/0A-ESP8266__Datasheet__EN_v4.3.pdf; RefDes: RefDes; Type: DEV; Value: Value
U7 = W25Q80DV: IC FLASH 8MBIT 104MHZ 8SOIC; Manufacturer_Part_Number: W25Q80DVSSIG; Manufacturer: Winbond; PIN_COUNT: 8; Price (1ku-$): 0.27255; Digi-Key Part Number: W25Q80DVSSIG-ND; Datasheet URL: http://www.winbond.com/resource-files/w25q80dv_revf_02112015.pdf; RefDes: RefDes; Type: DEV; Value: Value
X2 = XTAL_SMD2520: XTAL SMD 2520, 16MHz, 8pF, ±40ppm; Part Number: XTAL_SMD2520_16MHz_8pF_NDK; Manufacturer: NDK; Manufacturer Part Number: NX2520SA/16MHz/EXS00A-CS06713; Note: XTAL SMD 16.000MHz; Artikkelnr Noca: 22019192; Artikkelnr Simpro: N.A.; Datasheet: http://www.ndk.com/images/products/catalog/c_NX2520SA-STD-CSW-5_e.pdf; LatestRevisionDate: 2014-11-27; Pin Count: 4; Publisher: Nordic Semiconductor; Published: 2012-06-15; Value: 26MHz; Supplier: Digi-Key; Supplier part number: 644-1169-1-ND; 2nd source Supplier: *; 2nd source part number: *; Footprint Doc: XTAL_2520

## Sheet [5]-Display.SchDoc
size A3
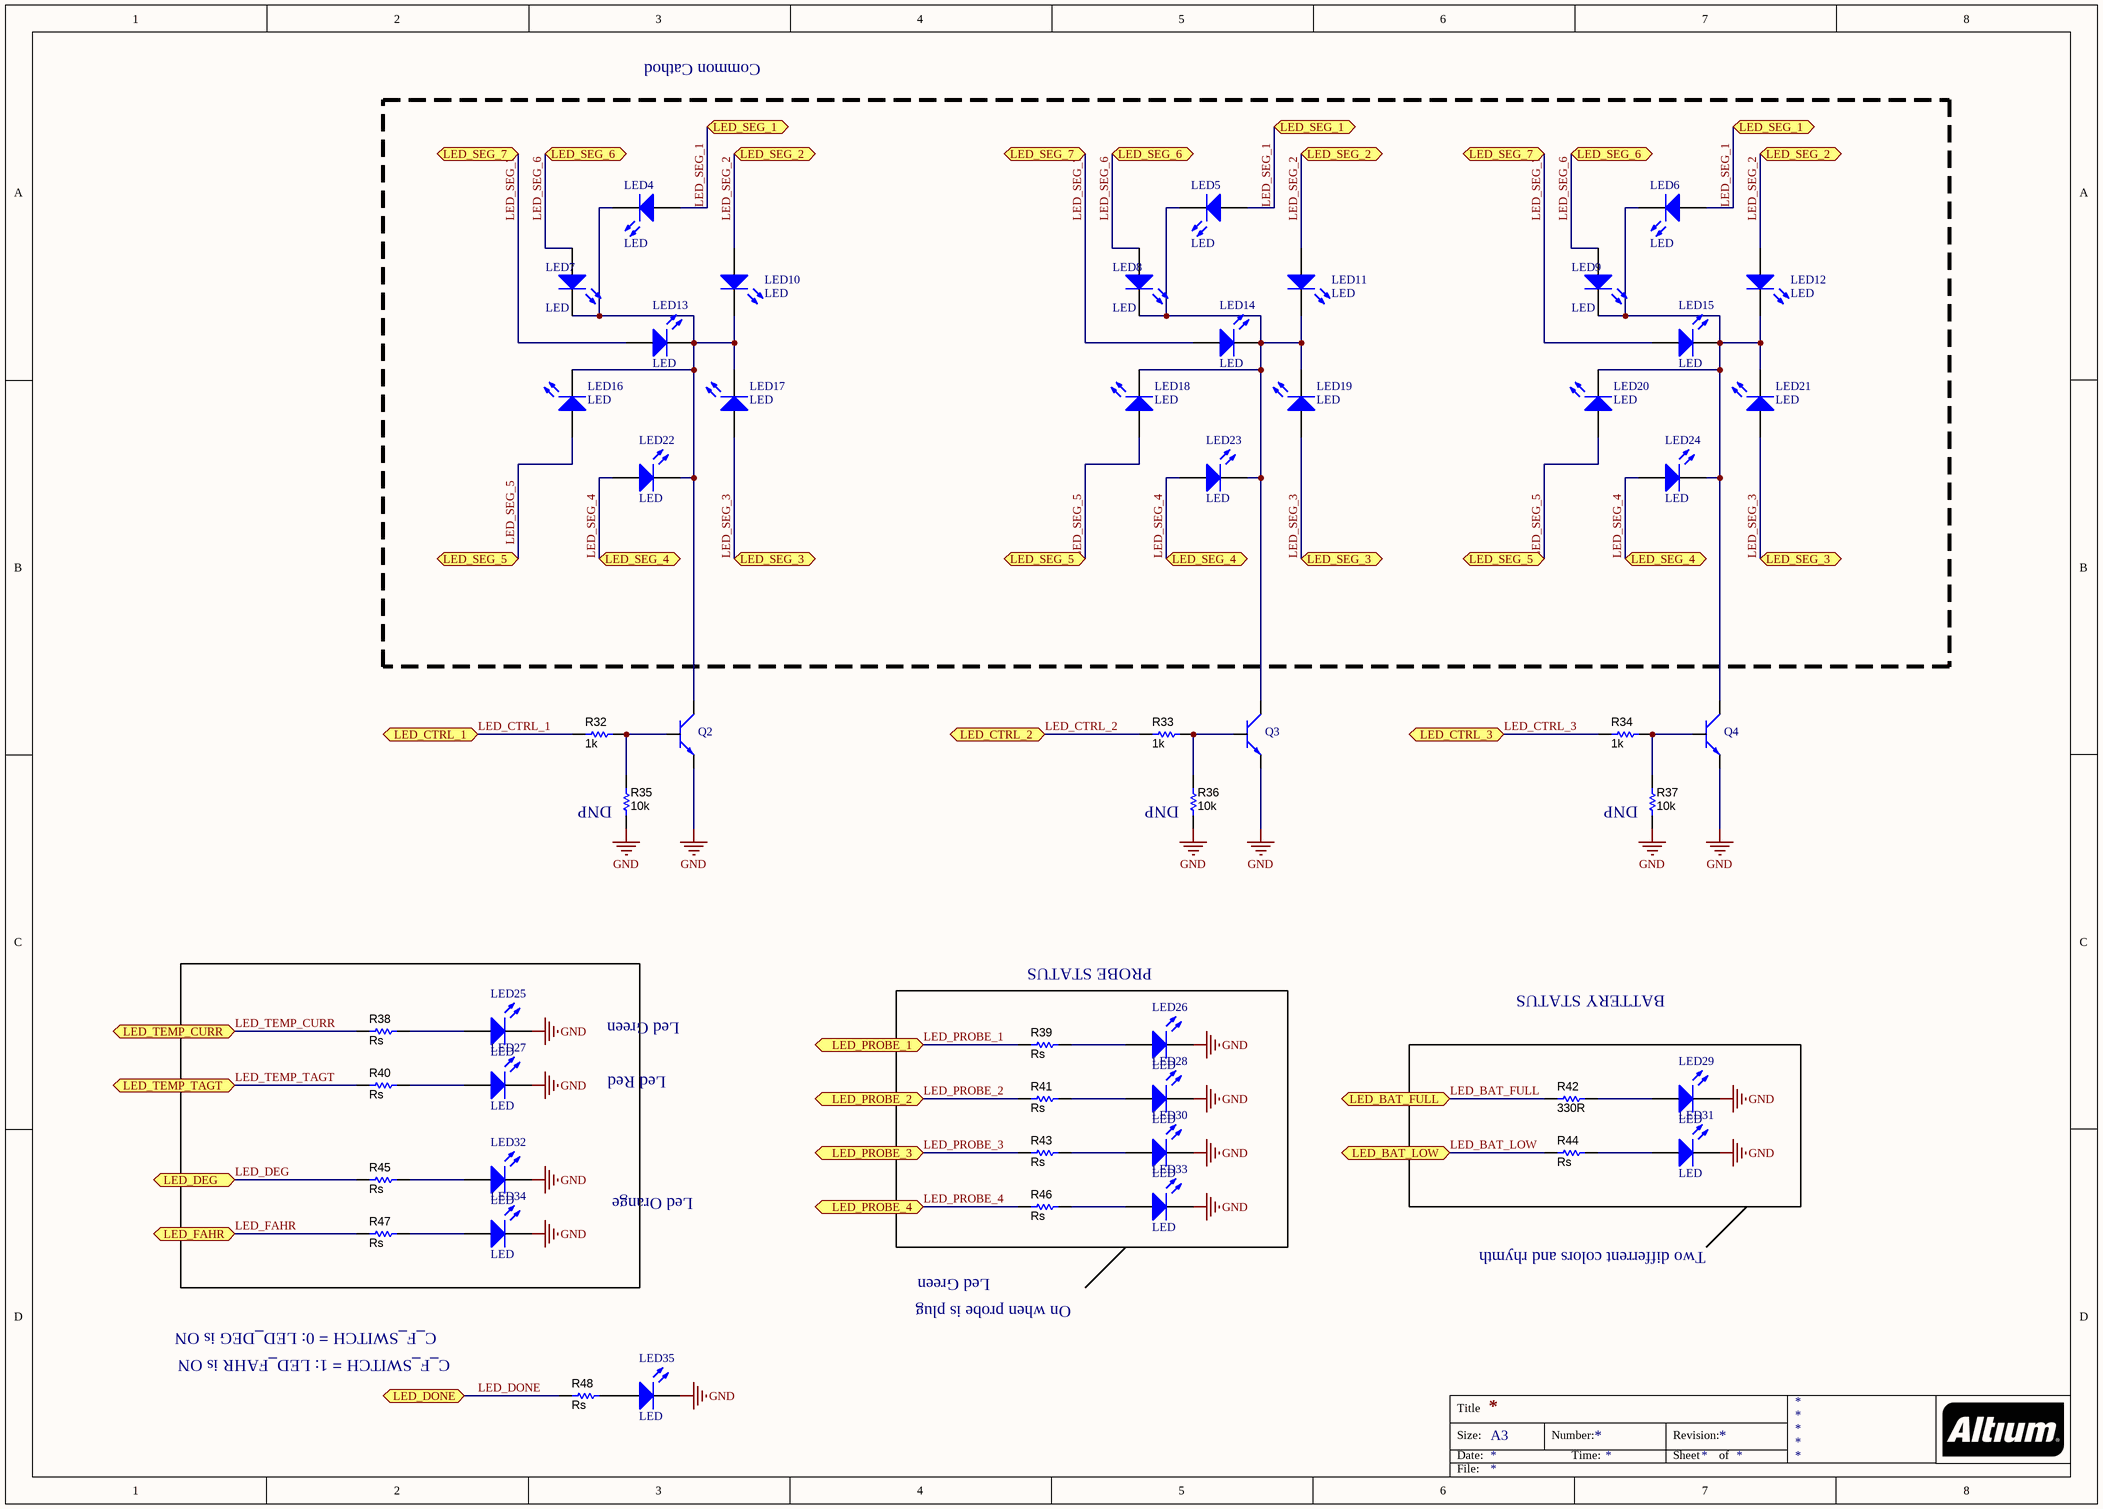
[diagram p4: [5]-Display.SchDoc]

### Parts
LED4  LED  [LED-0603-YELLOW]
LED5  LED  [LED-0603-YELLOW]
LED6  LED  [LED-0603-YELLOW]
LED7  LED  [LED-0603-YELLOW]
LED8  LED  [LED-0603-YELLOW]
LED9  LED  [LED-0603-YELLOW]
LED10  LED  [LED-0603-YELLOW]
LED11  LED  [LED-0603-YELLOW]
LED12  LED  [LED-0603-YELLOW]
LED13  LED  [LED-0603-YELLOW]
LED14  LED  [LED-0603-YELLOW]
LED15  LED  [LED-0603-YELLOW]
LED16  LED  [LED-0603-YELLOW]
LED17  LED  [LED-0603-YELLOW]
LED18  LED  [LED-0603-YELLOW]
LED19  LED  [LED-0603-YELLOW]
LED20  LED  [LED-0603-YELLOW]
LED21  LED  [LED-0603-YELLOW]
LED22  LED  [LED-0603-YELLOW]
LED23  LED  [LED-0603-YELLOW]
LED24  LED  [LED-0603-YELLOW]
LED25  LED  [LED-0603-YELLOW]
LED26  LED  [LED-0603-YELLOW]
LED27  LED  [LED-0603-YELLOW]
LED28  LED  [LED-0603-YELLOW]
LED29  LED  [LED-0603-YELLOW]
LED30  LED  [LED-0603-YELLOW]
LED31  LED  [LED-0603-YELLOW]
LED32  LED  [LED-0603-YELLOW]
LED33  LED  [LED-0603-YELLOW]
LED34  LED  [LED-0603-YELLOW]
LED35  LED  [LED-0603-YELLOW]
Q2  MMBT2222A  [SOT23A]  (value not drawn)
Q3  MMBT2222A  [SOT23A]  (value not drawn)
Q4  MMBT2222A  [SOT23A]  (value not drawn)
R32  value 1k  [0603]  (hidden comment: CRCW06031K00FKEA)
R33  value 1k  [0603]  (hidden comment: CRCW06031K00FKEA)
R34  value 1k  [0603]  (hidden comment: CRCW06031K00FKEA)
R35  value 10k  [0603]  (hidden comment: CRCW06031K00FKEA)
R36  value 10k  [0603]  (hidden comment: CRCW06031K00FKEA)
R37  value 10k  [0603]  (hidden comment: CRCW06031K00FKEA)
R38  value Rs  [0603]  (hidden comment: CRCW06031K00FKEA)
R39  value Rs  [0603]  (hidden comment: CRCW06031K00FKEA)
R40  value Rs  [0603]  (hidden comment: CRCW06031K00FKEA)
R41  value Rs  [0603]  (hidden comment: CRCW06031K00FKEA)
R42  value 330R  [0603]  (hidden comment: CRCW06031K00FKEA)
R43  value Rs  [0603]  (hidden comment: CRCW06031K00FKEA)
R44  value Rs  [0603]  (hidden comment: CRCW06031K00FKEA)
R45  value Rs  [0603]  (hidden comment: CRCW06031K00FKEA)
R46  value Rs  [0603]  (hidden comment: CRCW06031K00FKEA)
R47  value Rs  [0603]  (hidden comment: CRCW06031K00FKEA)
R48  value Rs  [0603]  (hidden comment: CRCW06031K00FKEA)

### Ports
LED_BAT_FULL (bidir), LED_BAT_LOW (bidir), LED_CTRL_1 (bidir), LED_CTRL_2 (bidir), LED_CTRL_3 (bidir), LED_DEG (bidir), LED_DONE (bidir), LED_FAHR (bidir), LED_PROBE_1 (bidir), LED_PROBE_2 (bidir), LED_PROBE_3 (bidir), LED_PROBE_4 (bidir), LED_SEG_1 (bidir), LED_SEG_2 (bidir), LED_SEG_3 (bidir), LED_SEG_4 (bidir), LED_SEG_5 (bidir), LED_SEG_6 (bidir), LED_SEG_7 (bidir), LED_TEMP_CURR (bidir), LED_TEMP_TAGT (bidir)

### Nets
GND: LED25.2(K) LED26.2(K) LED27.2(K) LED28.2(K) LED29.2(K) LED30.2(K) LED31.2(K) LED32.2(K) LED33.2(K) LED34.2(K) LED35.2(K) Q2.2(E) Q3.2(E) Q4.2(E) R35.1 R36.1 R37.1
LED_BAT_FULL: R42.2 ; port LED_BAT_FULL
LED_BAT_LOW: R44.2 ; port LED_BAT_LOW
LED_CTRL_1: R32.1 ; port LED_CTRL_1
LED_CTRL_2: R33.1 ; port LED_CTRL_2
LED_CTRL_3: R34.1 ; port LED_CTRL_3
LED_DEG: R45.2 ; port LED_DEG
LED_DONE: R48.2 ; port LED_DONE
LED_FAHR: R47.2 ; port LED_FAHR
LED_PROBE_1: R39.2 ; port LED_PROBE_1
LED_PROBE_2: R41.2 ; port LED_PROBE_2
LED_PROBE_3: R43.2 ; port LED_PROBE_3
LED_PROBE_4: R46.2 ; port LED_PROBE_4
LED_SEG_1: LED4.1(A) LED5.1(A) LED6.1(A) ; port LED_SEG_1
LED_SEG_2: LED10.1(A) LED11.1(A) LED12.1(A) ; port LED_SEG_2
LED_SEG_3: LED17.1(A) LED19.1(A) LED21.1(A) ; port LED_SEG_3
LED_SEG_4: LED22.1(A) LED23.1(A) LED24.1(A) ; port LED_SEG_4
LED_SEG_5: LED16.1(A) LED18.1(A) LED20.1(A) ; port LED_SEG_5
LED_SEG_6: LED7.1(A) LED8.1(A) LED9.1(A) ; port LED_SEG_6
LED_SEG_7: LED13.1(A) LED14.1(A) LED15.1(A) ; port LED_SEG_7
LED_TEMP_CURR: R38.2 ; port LED_TEMP_CURR
LED_TEMP_TAGT: R40.2 ; port LED_TEMP_TAGT
NetLED4_2: LED4.2(K) LED7.2(K) LED10.2(K) LED13.2(K) LED16.2(K) LED17.2(K) LED22.2(K) Q2.3(C)
NetLED5_2: LED5.2(K) LED8.2(K) LED11.2(K) LED14.2(K) LED18.2(K) LED19.2(K) LED23.2(K) Q3.3(C)
NetLED6_2: LED6.2(K) LED9.2(K) LED12.2(K) LED15.2(K) LED20.2(K) LED21.2(K) LED24.2(K) Q4.3(C)
NetLED25_1: LED25.1(A) R38.1
NetLED26_1: LED26.1(A) R39.1
NetLED27_1: LED27.1(A) R40.1
NetLED28_1: LED28.1(A) R41.1
NetLED29_1: LED29.1(A) R42.1
NetLED30_1: LED30.1(A) R43.1
NetLED31_1: LED31.1(A) R44.1
NetLED32_1: LED32.1(A) R45.1
NetLED33_1: LED33.1(A) R46.1
NetLED34_1: LED34.1(A) R47.1
NetLED35_1: LED35.1(A) R48.1
NetQ2_1: Q2.1(B) R32.2 R35.2
NetQ3_1: Q3.1(B) R33.2 R36.2
NetQ4_1: Q4.1(B) R34.2 R37.2

### Notes on the sheet
- Common Cathod
- (near R35) DNP
- (near R36) DNP
- (near R37) DNP
- PROBE STATUS
- BATTERY STATUS
- Led Green
- Led Red
- Led Orange
- Two differrent colors and rhymth
- C_F_SWITCH = 0: LED_DEG is ON
- On when probe is plug
- C_F_SWITCH = 1: LED_FAHR is ON
- Title
- Size:
- Date:
- A3
- Number:
- Time:
- Revision:
- Sheet
- of
- File:

### Library data of the parts
LED4-LED35 = LED: Typical INFRARED GaAs LED; Published: 8-Jun-2000; LatestRevisionDate: 08-Jul-2005; LatestRevisionNote: Mech Layer 1 removed.; PackageReference: LED-0; Publisher: Altium Limited; PackageDescription: LED; 2 Leads
Q2-Q4 = MMBT2222A: as Q1 on sheet [4]-Wifi; Name: MMBT2222; Vce: 40V; Datasheet: http://www.farnell.com/datasheets/1842966.pdf; Footprint: SOT23
R32-R48 = R0603: as R9 on sheet [3]-MCU; SymbolVersion: 2009-05-29; PartNumber: CRCW06031K00FKEA; PackageReference: 0603; RoHS: Y; Value1: 1%; Value2: 0.1W; MountType: SMT; Technology: Thick Film; Published: 2008-06-26; Publisher: Texas Instruments; LatestRevisionDate: 2012-10-04; LatestRevisionNote: Changed publisher; ComponentLink1Description: Datasheet link; ComponentLink1URL: http://www.vishay.com/docs/20035/dcrcwe3.pdf; Supplier 1: Digi-Key; Supplier Part Number 1: 541-1.00KHCT-ND; Supplier 2: Farnell; Supplier Part Number 2: 1151593; Supplier 3: Newark; Supplier Part Number 3: 52K8015

## Nets that join several sheets
GND: [2]-Charger (19 pins), [3]-MCU (36 pins), [4]-Wifi (20 pins), [5]-Display (17 pins)
V_ESP: [2]-Charger (6 pins), [3]-MCU (J7.1), [4]-Wifi (15 pins)
BAT_MEASURE: [2]-Charger (C5.1 R7.1 R8.2), [3]-MCU (U3.12)
GPIO0: [3]-MCU (U3.1), [4]-Wifi (J17.1 R24.1 U6.15)
GPIO12: [3]-MCU (U3.28), [4]-Wifi (U6.10)
GPIO13: [3]-MCU (U3.27), [4]-Wifi (U6.12)
GPIO14: [3]-MCU (U3.29), [4]-Wifi (U6.16)
LED_BAT_FULL: [3]-MCU (U3.39), [5]-Display (R42.2)
LED_BAT_LOW: [3]-MCU (U3.40), [5]-Display (R44.2)
LED_CTRL_1: [3]-MCU (U3.54), [5]-Display (R32.1)
LED_CTRL_2: [3]-MCU (U3.53), [5]-Display (R33.1)
LED_CTRL_3: [3]-MCU (U3.52), [5]-Display (R34.1)
LED_DEG: [3]-MCU (U3.41), [5]-Display (R45.2)
LED_DONE: [3]-MCU (U3.20), [5]-Display (R48.2)
LED_FAHR: [3]-MCU (U3.42), [5]-Display (R47.2)
LED_PROBE_1: [3]-MCU (U3.8), [5]-Display (R39.2)
LED_PROBE_2: [3]-MCU (U3.9), [5]-Display (R41.2)
LED_PROBE_3: [3]-MCU (U3.10), [5]-Display (R43.2)
LED_PROBE_4: [3]-MCU (U3.11), [5]-Display (R46.2)
LED_SEG_1: [3]-MCU (U3.43), [5]-Display (LED4.1 LED5.1 LED6.1)
LED_SEG_2: [3]-MCU (U3.44), [5]-Display (LED10.1 LED11.1 LED12.1)
LED_SEG_3: [3]-MCU (U3.45), [5]-Display (LED17.1 LED19.1 LED21.1)
LED_SEG_4: [3]-MCU (U3.46), [5]-Display (LED22.1 LED23.1 LED24.1)
LED_SEG_5: [3]-MCU (U3.49), [5]-Display (LED16.1 LED18.1 LED20.1)
LED_SEG_6: [3]-MCU (U3.50), [5]-Display (LED7.1 LED8.1 LED9.1)
LED_SEG_7: [3]-MCU (U3.51), [5]-Display (LED13.1 LED14.1 LED15.1)
LED_TEMP_CURR: [3]-MCU (U3.17), [5]-Display (R38.2)
LED_TEMP_TAGT: [3]-MCU (U3.18), [5]-Display (R40.2)
RESET_ESP: [3]-MCU (U3.2), [4]-Wifi (R22.1)
U0_RX_ESP8266: [3]-MCU (U3.24), [4]-Wifi (J18.0 R27.1)
U0_TX_ESP8266: [3]-MCU (U3.23), [4]-Wifi (J19.0 R28.1)
USB_D_N: [2]-Charger (USB1.2), [3]-MCU (U3.6)
USB_D_P: [2]-Charger (USB1.3), [3]-MCU (U3.5)